# EAGLE schematic Canberry 2.0 (EAGLE 6.6.0)
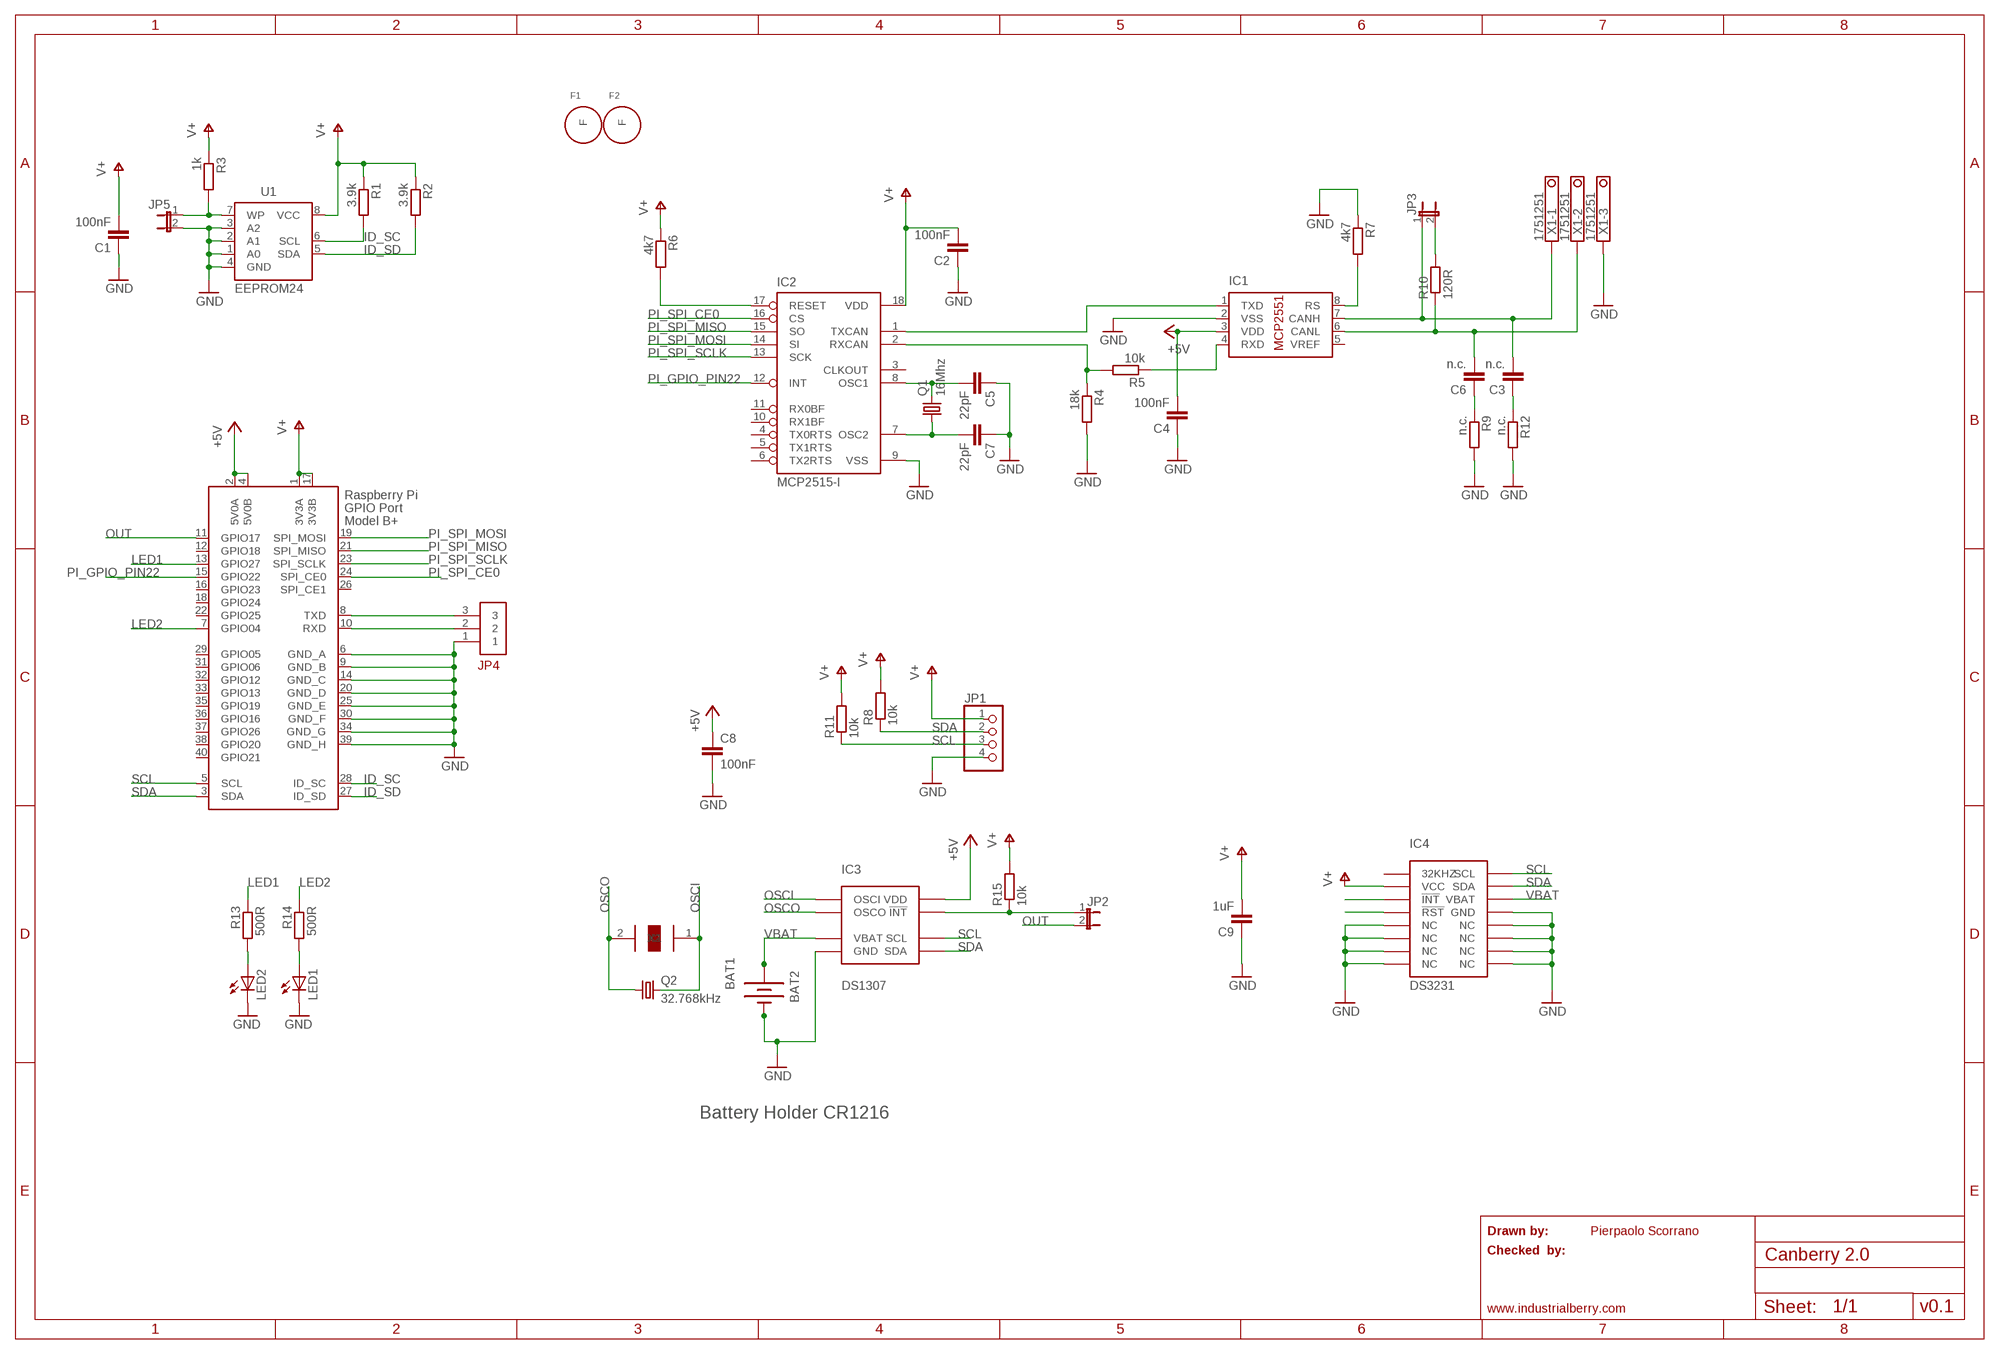
[diagram p0: schematic, sheet 1]

## Parts
BAT1  BATTERY12MM  [BATTCON_12MM]
BAT2  BATTERY12PTH  [BATTCON_12MM_PTH]
C1  100nF  C-EUC0603  [C0603]
C2  100nF  C-EUC0603  [C0603]
C3  n.c.  C-EUC0603  [C0603]
C4  100nF  C-EUC0603  [C0603]
C5  22pF  C-EUC0603  [C0603]
C6  n.c.  C-EUC0603  [C0603]
C7  22pF  C-EUC0603  [C0603]
C8  100nF  C-EUC0603  [C0603]
C9  1uF  C-EUC0603  [C0603]
F1  FIDUCIAL-LAMINA  [FIDUCIAL-LAMINA]
F2  FIDUCIAL-LAMINA  [FIDUCIAL-LAMINA]
IC1  MCP2551  MCP2551/SN  [SO08]
IC2  MCP2515-I  MCP2515-I/SOGRB2  [SO18L]
IC3  DS1307  PCF8523SOIC8  [SO8]
IC4  DS3231  DS3231SOIC-16W  [SOIC-16W]
JP1  PINHD-1X4  [1X04]
JP2  JUMPER-2SMD-NO  [SJ_2S-NO]
JP3  JUMPER-2SMD-NO  [SJ_2S-NO]
JP4  MA03-1  [MA03-1]
JP5  JUMPER-2SMD-NO  [SJ_2S-NO]
LED1  LEDSMT1206  [1206]
LED2  LEDSMT1206  [1206]
Q1  16Mhz  CRYSTAL10.5X4.8  [CRYSTAL-SMD-10.5X4.8-2PIN]
Q2  32.768kHz  CRYSTALTC26H  [TC26H]
R1  3.9k  R-EU_R0603  [R0603]
R2  3.9k  R-EU_R0603  [R0603]
R3  1k  R-EU_R0603  [R0603]
R4  18k  R-EU_R0603  [R0603]
R5  10k  R-EU_R0603  [R0603]
R6  4k7  R-EU_R0603  [R0603]
R7  4k7  R-EU_R0603  [R0603]
R8  10k  R-EU_R0603  [R0603]
R9  n.c.  R-EU_R0603  [R0603]
R10  120R  R-EU_R0603  [R0603]
R11  10k  R-EU_R0603  [R0603]
R12  n.c.  R-EU_R0603  [R0603]
R13  500R  R-EU_R0603  [R0603]
R14  500R  R-EU_R0603  [R0603]
R15  10k  R-EU_R0603  [R0603]
RPI1  RASPBERRY_HATSMT  [CONNECTOR_B+_SMT]
U1  EEPROM24  [SOIC8]
U$1  XTAL32K  [FC-135]
X1  1751251  [1751251]

## Nets
+5V: C4.2 C8.1 IC1.3(VDD) IC3.8(VDD) RPI1.2(5V0A) RPI1.4(5V0B)
GND: BAT1.GND(-) BAT2.GND(-) C1.1 C2.1 C4.1 C5.1 C7.1 C8.2 C9.1 IC1.2(VSS) IC2.9(VSS) IC3.4(GND) IC4.5(NC) IC4.6(NC) IC4.7(NC) IC4.8(NC) IC4.9(NC) IC4.10(NC) IC4.11(NC) IC4.12(NC) IC4.13(GND) JP1.4 JP4.1 JP5.2 LED1.C LED2.C R4.2 R7.1 R9.2 R12.2 RPI1.6(GND_A) RPI1.9(GND_B) RPI1.14(GND_C) RPI1.20(GND_D) RPI1.25(GND_E) RPI1.30(GND_F) RPI1.34(GND_G) RPI1.39(GND_H) U1.1(A0) U1.2(A1) U1.3(A2) U1.4(GND) X1.3
ID_SC: R1.2 RPI1.28(ID_SC) U1.6(SCL)
ID_SD: R2.2 RPI1.27(ID_SD) U1.5(SDA)
LED1: R13.1 RPI1.13(GPIO27)
LED2: R14.1 RPI1.7(GPIO04)
N$1: IC4.4(!RST)
N$3: JP5.1 R3.2 U1.7(WP)
N$4: IC3.7(!INT) IC4.3(!INT) JP2.1 R15.1
N$6: C7.2 IC2.7(OSC2) Q1.P$1
N$7: IC2.2(RXCAN) R4.1 R5.2
N$8: IC1.4(RXD) R5.1
N$9: IC1.1(TXD) IC2.1(TXCAN)
N$10: IC1.8(RS) R7.2
N$11: IC2.17(RESET) R6.2
N$12: C6.1 R9.1
N$13: C3.1 R12.1
N$14: LED2.A R13.2
N$15: C5.2 IC2.8(OSC1) Q1.P$2
N$16: LED1.A R14.2
N$22: C3.2 IC1.7(CANH) JP3.1 X1.1
N$23: C6.2 IC1.6(CANL) R10.1 X1.2
N$24: JP3.2 R10.2
OSCI: IC3.1(OSCI) Q2.2 U$1.1(X1)
OSCO: IC3.2(OSCO) Q2.1 U$1.2(X2)
OUT: JP2.2 RPI1.11(GPIO17)
PI_GPIO_PIN22: IC2.12(INT) RPI1.15(GPIO22)
PI_SPI_CE0: IC2.16(CS) RPI1.24(SPI_CE0)
PI_SPI_MISO: IC2.15(SO) RPI1.21(SPI_MISO)
PI_SPI_MOSI: IC2.14(SI) RPI1.19(SPI_MOSI)
PI_SPI_SCLK: IC2.13(SCK) RPI1.23(SPI_SCLK)
RXD: JP4.2 RPI1.10(RXD)
SCL: IC3.6(SCL) IC4.16(SCL) JP1.3 R11.1 RPI1.5(SCL)
SDA: IC3.5(SDA) IC4.15(SDA) JP1.2 R8.1 RPI1.3(SDA)
TXD: JP4.3 RPI1.8(TXD)
V+: C1.2 C2.2 C9.2 IC2.18(VDD) IC4.2(VCC) JP1.1 R1.1 R2.1 R3.1 R6.1 R8.2 R11.2 R15.2 RPI1.1(3V3A) RPI1.17(3V3B) U1.8(VCC)
VBAT: BAT1.PWR@1(+) BAT2.VCC@1(+) IC3.3(VBAT) IC4.14(VBAT)
Unconnected: F1.P$1(F) F2.P$1(F) IC1.5(VREF) IC2.3(CLKOUT) IC2.4(TX0RTS) IC2.5(TX1RTS) IC2.6(TX2RTS) IC2.10(RX1BF) IC2.11(RX0BF) IC4.1(32KHZ) RPI1.12(GPIO18) RPI1.16(GPIO23) RPI1.18(GPIO24) RPI1.22(GPIO25) RPI1.26(SPI_CE1) RPI1.29(GPIO05) RPI1.31(GPIO06) RPI1.32(GPIO12) RPI1.33(GPIO13) RPI1.35(GPIO19) RPI1.36(GPIO16) RPI1.37(GPIO26) RPI1.38(GPIO20) RPI1.40(GPIO21)

## Notes on the sheet
- Battery Holder CR1216
- Drawn by: | Pierpaolo Scorrano
- Checked  by:
- www.industrialberry.com | v0.1

## Library data of the parts
BAT1 BAT2 = SparkFun:BATTERY: Battery Holders Various common sizes : AA, AAA, 20mm coin cell and 12mm coin cell.
C1-C9 = rcl:C-EU: CAPACITOR, European symbol
F1 F2 = PierpaoloSmartSpaceSolutions:FIDUCIAL-LAMINA
IC1 = microchip-dspic:MCP2551: High-Speed CAN Transceiver
IC2 = mcp2515:MCP2515
IC3 = PierpaoloSmartSpaceSolutions:PCF8523
IC4 = DS3231_industrialberry:DS3231
JP1 = pinhead:PINHD-1X4: PIN HEADER
JP2 JP3 JP5 = SparkFun:JUMPER-2: Jumper Basic 0.1" spaced jumper. Use with breakaway headers.
JP4 = MirkoSmartSpaceSolutions:MA03-1: PIN HEADER
LED1 LED2 = led:LED: LED OSRAM: - CHIPLED LG R971, LG N971, LY N971, LG Q971, LY Q971, LO R971, LY R971 LH N974, LH R974 LS Q976, LO Q976, LY Q976 LO Q996 - Hyper CHIPLED LW Q18S LB Q993, LB Q99A, LB R99A - SideLED LS A670, LO A670, LY A670, LG A670, LP A670 LB A673, LV A673, LT A673, LW A673 LH A674 LY A675 LS A676, LA A676, LO A676, LY A676, LW A676 LS A679, LY A679, LG A679 - Hyper Micro SIDELED® LS Y876, LA Y876, LO Y876, LY Y876 LT Y87S - SmartLED LW L88C, LW L88S LB L89C, LB L89S, LG L890 LS L89K, LO L89K, LY L89K LS L896, LA L896, LO L896, LY L896 - TOPLED LS T670, LO T670, LY T670, LG T670, LP T670 LSG T670, LSP T670, LSY T670, LOP T670, LYG T670 LG T671, LOG T671, LSG T671 LB T673, LV T673, LT T673, LW T673 LH T674 LS T676, LA T676, LO T676, LY T676, LB T676, LH T676, LSB T676, LW T676 LB T67C, LV T67C, LT T67C, LS T67K, LO T67K, LY T67K, LW E67C LS E67B, LA E67B, LO E67B, LY E67B, LB E67C, LV E67C, LT E67C LW T67C LS T679, LY T679, LG T679 LS T770, LO T770, LY T770, LG T770, LP T770 LB T773, LV T773, LT T773, LW T773 LH T774 LS E675, LA E675, LY E675, LS T675 LS T776, LA T776, LO T776, LY T776, LB T776 LHGB T686 LT T68C, LB T68C - Hyper Mini TOPLED® LB M676 - Mini TOPLED Santana® LG M470 LS M47K, LO M47K, LY M47K Source: http://www.osram.convergy.de LUXEON: - LUMILED® LXK2-PW12-R00, LXK2-PW12-S00, LXK2-PW14-U00, LXK2-PW14-V00 LXK2-PM12-R00, LXK2-PM12-S00, LXK2-PM14-U00 LXK2-PE12-Q00, LXK2-PE12-R00, LXK2-PE12-S00, LXK2-PE14-T00, LXK2-PE14-U00 LXK2-PB12-K00, LXK2-PB12-L00, LXK2-PB12-M00, LXK2-PB14-N00, LXK2-PB14-P00, LXK2-PB14-Q00 LXK2-PR12-L00, LXK2-PR12-M00, LXK2-PR14-Q00, LXK2-PR14-R00 LXK2-PD12-Q00, LXK2-PD12-R00, LXK2-PD12-S00 LXK2-PH12-R00, LXK2-PH12-S00 LXK2-PL12-P00, LXK2-PL12-Q00, LXK2-PL12-R00 Source: www.luxeon.com KINGBRIGHT: KA-3528ASYC Source: www.kingbright.com
Q1 = SparkFun:CRYSTAL: Crystals Various standard crystals. Proven footprints. Spark Fun Electronics SKU : COM-00534
Q2 = crystal:CRYSTAL: CRYSTAL
R1-R15 = rcl:R-EU_: RESISTOR, European symbol
RPI1 = Connector_B+:RASPBERRY_HAT
U1 = FLYFISH:EEPROM24
U$1 = PierpaoloSmartSpaceSolutions:XTAL32K
X1 = con-phoenix-350:1751251: MKDS 1/ 3-3,5 Printklemme Nennstrom: 10 A Bemessungsspannung: 160 V Raster: 3,5 mm Polzahl: 3 Montageart: Löten Anschlussart: Schraubanschluss Anschlussrichtung vom Leiter zur Platine: 0° Source: http://eshop.phoenixcontact.com .. 1751251.pdf